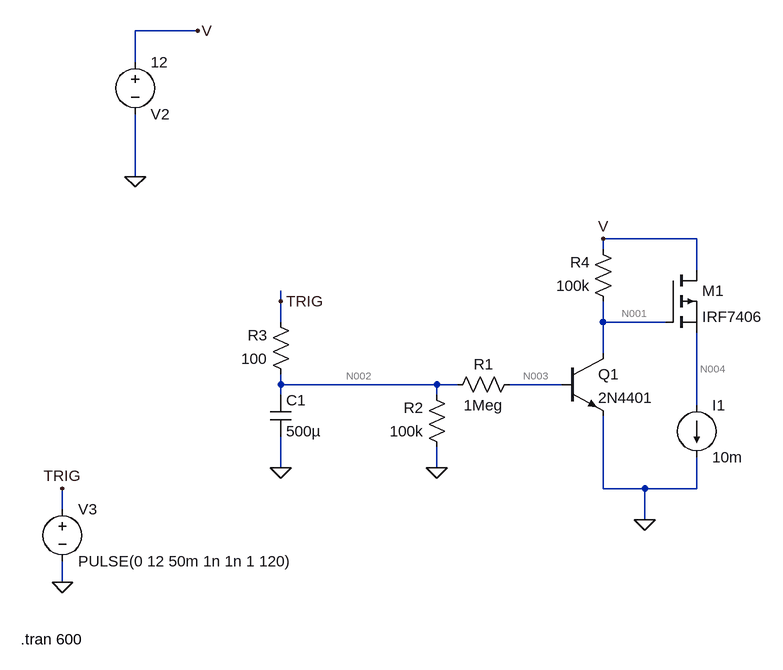
[diagram p0: schematic Draft2.asc]
Draft2.asc, the LTspice schematic file:
Version 4
SHEET 1 1256 716
WIRE -432 -304 -528 -304
WIRE -528 -256 -528 -304
WIRE -528 -80 -528 -176
WIRE 336 16 192 16
WIRE 192 32 192 16
WIRE 336 64 336 16
WIRE -304 112 -304 96
WIRE -304 144 -304 112
WIRE 192 144 192 112
WIRE 288 144 192 144
WIRE 192 192 192 144
WIRE -304 240 -304 224
WIRE -64 240 -304 240
WIRE -32 240 -64 240
WIRE 128 240 48 240
WIRE -304 256 -304 240
WIRE -64 256 -64 240
WIRE 336 272 336 160
WIRE -304 368 -304 320
WIRE -64 368 -64 336
WIRE 192 400 192 288
WIRE 256 400 192 400
WIRE 336 400 336 352
WIRE 336 400 256 400
WIRE -640 432 -640 400
WIRE 256 448 256 400
WIRE -640 544 -640 512
FLAG -432 -304 V
FLAG -640 544 0
FLAG -640 400 TRIG
FLAG -64 368 0
FLAG -304 368 0
FLAG -304 112 TRIG
FLAG 192 16 V
FLAG -528 -80 0
FLAG 256 448 0
SYMBOL voltage -528 -272 R0
WINDOW 0 24 96 Left 2
WINDOW 3 24 16 Left 2
WINDOW 123 0 0 Left 0
WINDOW 39 0 0 Left 0
SYMATTR InstName V2
SYMATTR Value 12
SYMBOL voltage -640 416 R0
WINDOW 123 0 0 Left 0
WINDOW 39 0 0 Left 0
SYMATTR InstName V3
SYMATTR Value PULSE(0 12 50m 1n 1n 1 120)
SYMBOL npn 128 192 R0
SYMATTR InstName Q1
SYMATTR Value 2N4401
SYMBOL res 64 224 R90
WINDOW 0 0 56 VBottom 2
WINDOW 3 32 56 VTop 2
SYMATTR InstName R1
SYMATTR Value 1Meg
SYMBOL res -48 352 R180
WINDOW 0 36 76 Left 2
WINDOW 3 36 40 Left 2
SYMATTR InstName R2
SYMATTR Value 100k
SYMBOL cap -320 256 R0
SYMATTR InstName C1
SYMATTR Value 500µ
SYMBOL res -288 240 R180
WINDOW 0 36 76 Left 2
WINDOW 3 36 40 Left 2
SYMATTR InstName R3
SYMATTR Value 100
SYMBOL pmos 288 64 R0
SYMATTR InstName M1
SYMATTR Value IRF7406
SYMBOL res 208 128 R180
WINDOW 0 36 76 Left 2
WINDOW 3 36 40 Left 2
SYMATTR InstName R4
SYMATTR Value 100k
SYMBOL current 336 272 R0
WINDOW 123 0 0 Left 0
WINDOW 39 0 0 Left 0
SYMATTR InstName I1
SYMATTR Value 10m
TEXT -704 632 Left 2 !.tran 600

The netlist it stands for:
* Draft2.asc
V2 V 0 12
V3 TRIG 0 PULSE(0 12 50m 1n 1n 1 120)
Q1 N001 N003 0 0 2N4401
R1 N003 N002 1Meg
R2 0 N002 100k
C1 N002 0 500µ
R3 N002 TRIG 100
M1 V N001 N004 N004 IRF7406
R4 N001 V 100k
I1 N004 0 10m
.model NPN NPN
.model PNP PNP
.lib standard.bjt
.model NMOS NMOS
.model PMOS PMOS
.lib standard.mos
.tran 600
.backanno
.end

* Results of the author's LTspice run, read from the files saved beside the schematic
* Operating Point, zero values left out:
*   V(v) = 12 V
*   V(n001) = 12 V
*   V(n003) = 12.03 µV
*   V(n004) = 11.51 V
*   Ic(Q1) = 12.05 pA
*   Ib(Q1) = -12.03 pA
*   Id(M1) = 10 mA
*   Is(M1) = -10 mA
*   I(I1) = 10 mA
*   I(R4) = -12.05 pA
*   I(R3) = 12.01 pA
*   I(R1) = 12.03 pA
*   I(V3) = 12.01 pA
*   I(V2) = -10 mA
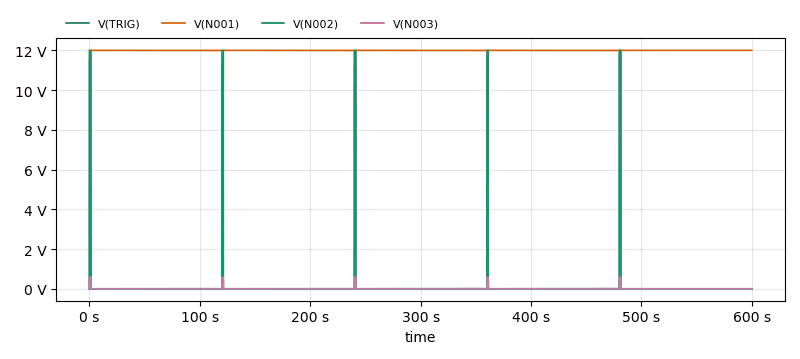
[diagram p1: Transient Analysis of Draft2.asc, plotted from the saved traces]
* Transient Analysis, 1 run:
*   V(TRIG): min 0 V, max 12 V, average 100 mV, rms 1.095 V, last 0 V
*   V(N001): min 68.89 mV, max 12 V, average 11.89 V, rms 11.94 V, last 12 V
*   V(N002): min 0 V, max 11.99 V, average 99.78 mV, rms 1.066 V, last 0 V
*   V(N003): min -5.687 µV, max 579.6 mV, average 5.772 mV, rms 57.01 mV, last 12.01 µV